# Altium schematic sheet SCH_ARDUINO_UNO-KMA.SchDoc: Arduino Limited Version KMA
size A2; Date: 01/11/2024; Author: Đậu Thành Trung; Organization: ORGANIZATION; Address1: ADDRESS 1; Address2: ADDRESS 2; Address3: ADDRESS 3; Address4: ADDRESS 4; Revision: -; SheetNumber: 1; SheetTotal: 1; Mail: dauthanhtrung.kma@gmail.com; Phone: 0868.24.2509
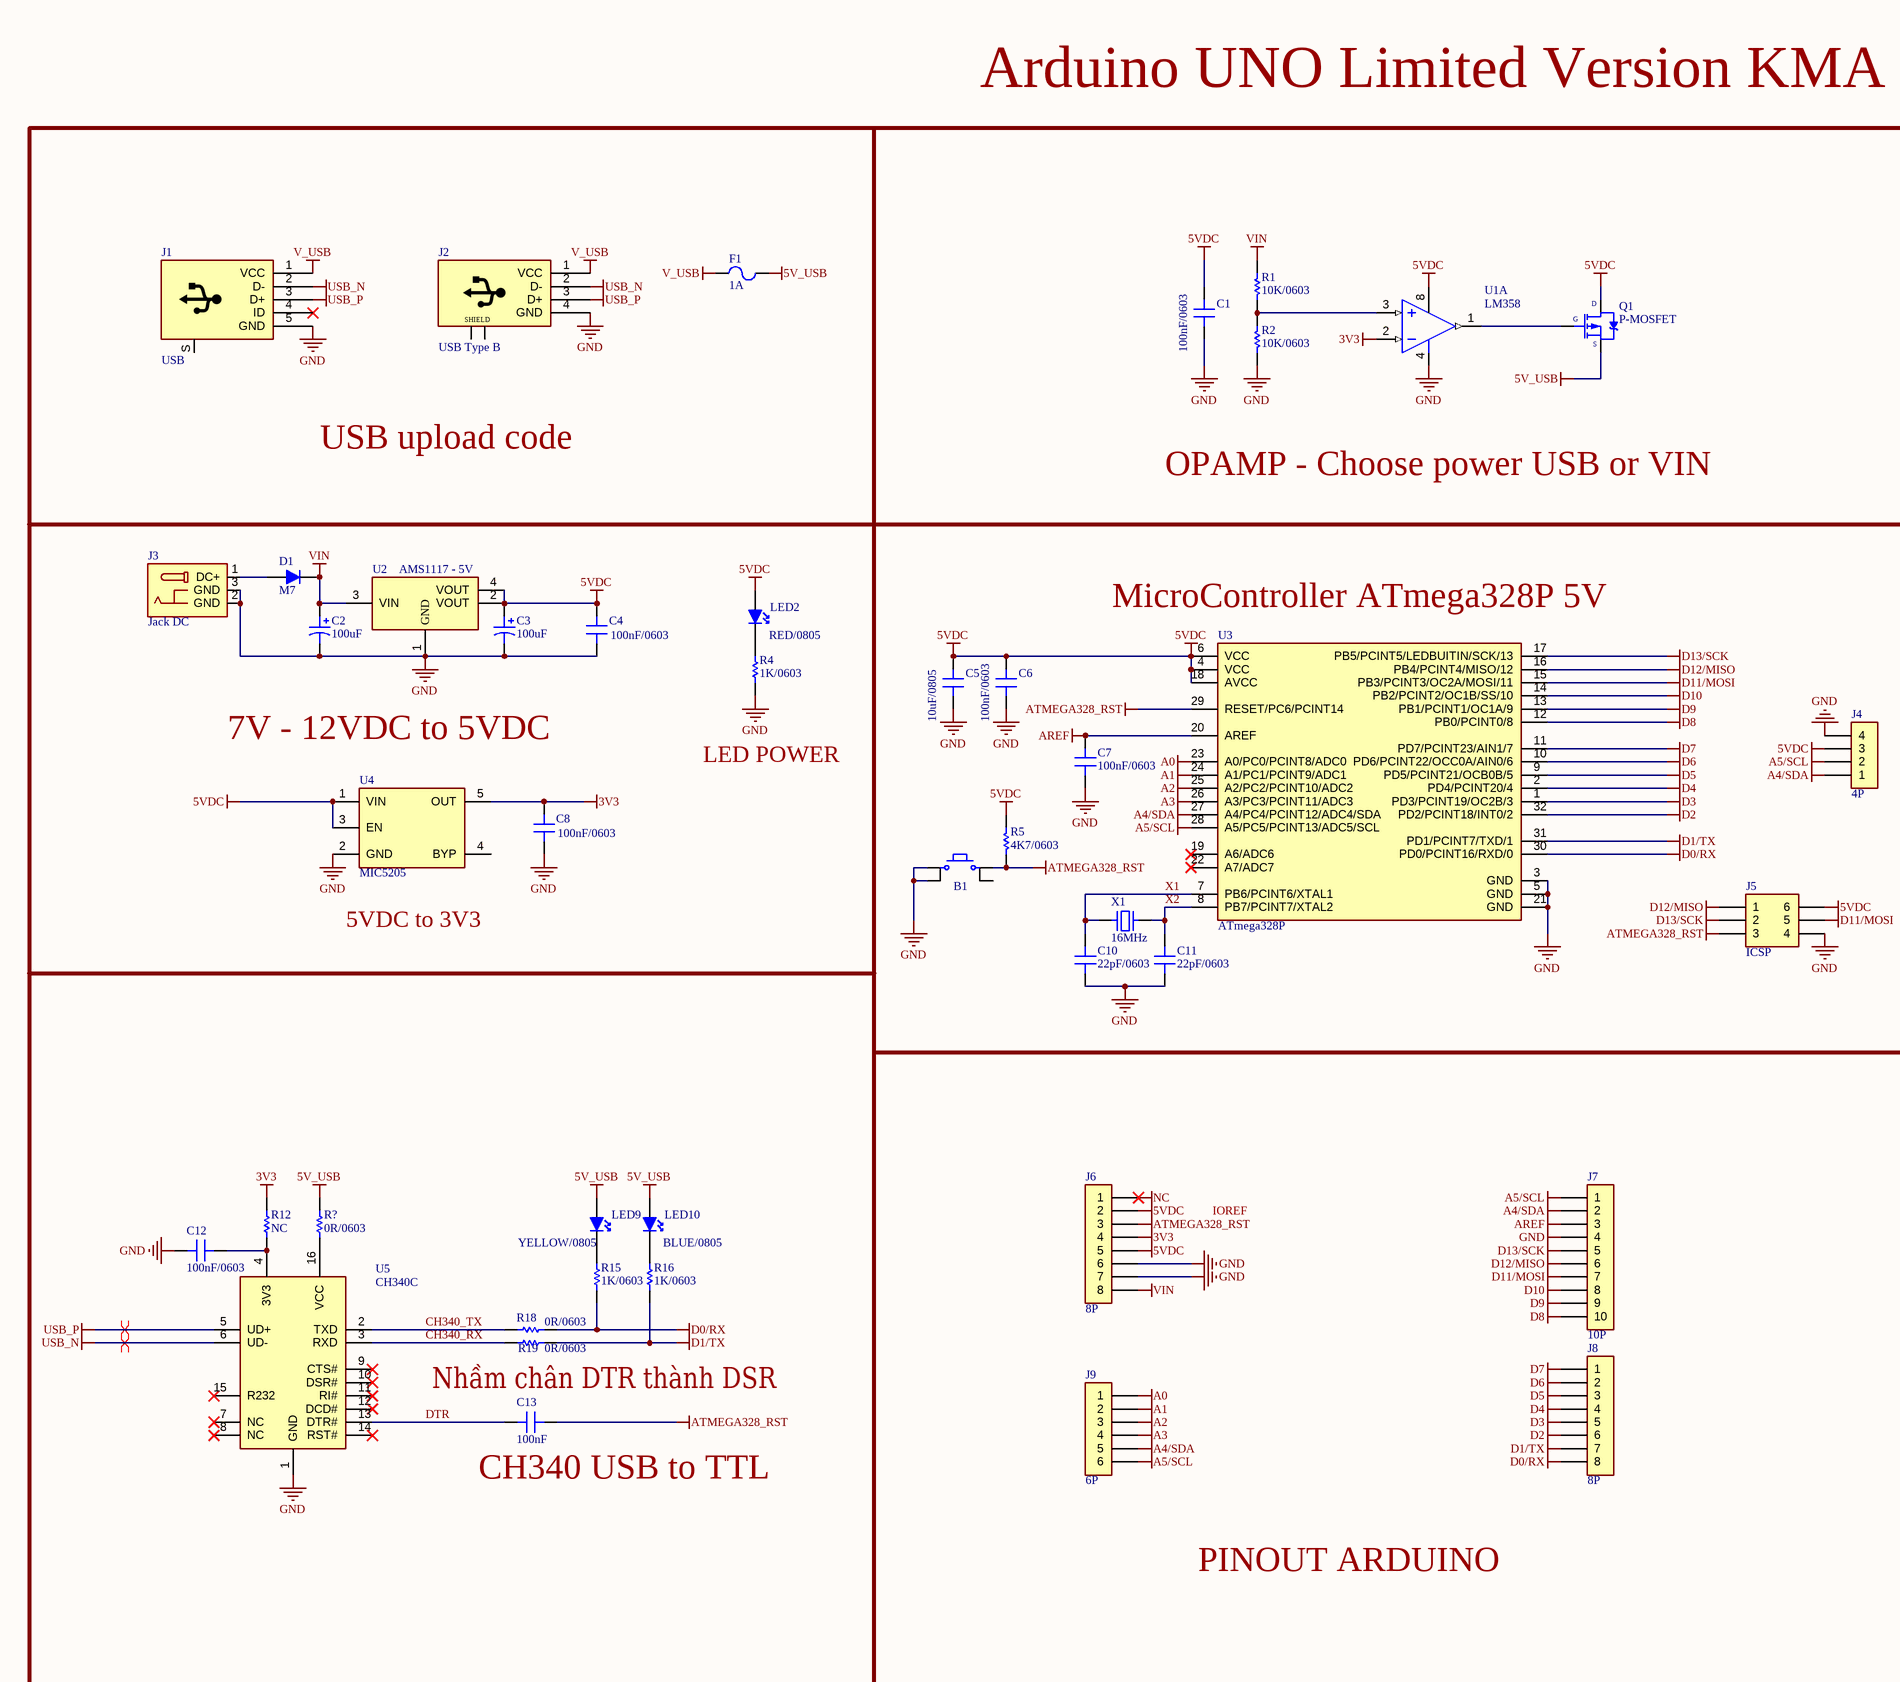
[diagram p0: SCH_ARDUINO_UNO-KMA.SchDoc, left]
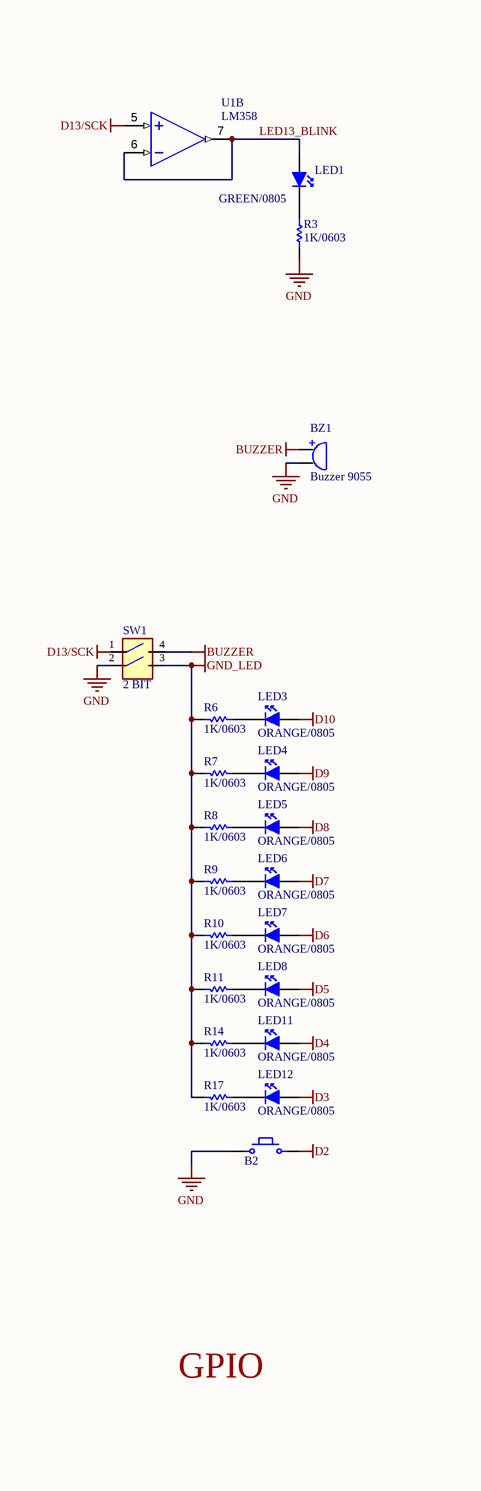
[diagram p1: SCH_ARDUINO_UNO-KMA.SchDoc, right]

## Parts
?  (no value)  (no BOM)
B1  (no value)  [BUTTON-SMD-4P-6X6X3.1MM]
B2  (no value)  [BUTTON-SMD-2P-3x6x5MM]
BZ1  Buzzer 9055  [BUZZER_9055]
C1  100nF/0603  [CAP-0603]
C2  100uF  [CAPP-SMD-ALU-6.3X5.4MM-D]
C3  100uF  [CAPP-SMD-ALU-6.3X5.4MM-D]
C4  100nF/0603  [CAP-0603]
C5  10uF/0805  [CAP-0805]
C6  100nF/0603  [CAP-0603]
C7  100nF/0603  [CAP-0603]
C8  100nF/0603  [CAP-0603]
C10  22pF/0603  [CAP-0603]
C11  22pF/0603  [CAP-0603]
C12  100nF/0603  [CAP-0603]
C13  100nF  [CAP-0603]
D1  M7  [DIODE-SMD-DO-214AC]
F1  1A  [FUSE-SMD-PTC-1206]
J1  USB  [USB-FEMALE-MICRO-DIP]
J2  USB Type B  [USB-FEMALE-TYPE-B]
J3  Jack DC  [JACK-DC-5.5X2.1MM]
J4  4P  [JUMP-2.54-MALE-4P-NB]
J5  ICSP  [JUMP-2.54-MALE-2X3P]  (no BOM)
J6  8P  [JUMP-2.54-FEMALE-8P]
J7  10P  [JUMP-2.54-FEMALE-10P]
J8  8P  [JUMP-2.54-FEMALE-8P]
J9  6P  [JUMP-2.54-FEMALE-6P]
LED1  GREEN/0805  [LED-0805-GREEN]
LED2  RED/0805  [LED-0805-RED]
LED3  ORANGE/0805  [LED-0805-ORANGE]
LED4  ORANGE/0805  [LED-0805-ORANGE]
LED5  ORANGE/0805  [LED-0805-ORANGE]
LED6  ORANGE/0805  [LED-0805-ORANGE]
LED7  ORANGE/0805  [LED-0805-ORANGE]
LED8  ORANGE/0805  [LED-0805-ORANGE]
LED9  YELLOW/0805  [LED-0805-YELLOW]
LED10  BLUE/0805  [LED-0805-BLUE]
LED11  ORANGE/0805  [LED-0805-ORANGE]
LED12  ORANGE/0805  [LED-0805-ORANGE]
Q1  P-MOSFET  [MOSFET-SOT23-123]
R1  10K/0603  [RES-0603]
R2  10K/0603  [RES-0603]
R3  1K/0603  [RES-0603]
R4  1K/0603  [RES-0603]
R5  4K7/0603  [RES-0603]
R6  1K/0603  [RES-0603]
R7  1K/0603  [RES-0603]
R8  1K/0603  [RES-0603]
R9  1K/0603  [RES-0603]
R10  1K/0603  [RES-0603]
R11  1K/0603  [RES-0603]
R12  NC  [RES-0603]
R14  1K/0603  [RES-0603]
R15  1K/0603  [RES-0603]
R16  1K/0603  [RES-0603]
R17  1K/0603  [RES-0603]
R18  0R/0603  [RES-0603]
R19  0R/0603  [RES-0603]
R?  0R/0603  [RES-0603]
SW1  2 BIT  [BIT-SW-2P]
U1  LM358  [SOP-8]  (parts A,B of 2)
U2  AMS1117 - 5V  [SOT-223]
U3  ATmega328P  [TQFP-32]
U4  MIC5205  [SOT-23-5]
U5  CH340C  [SOP-16]
X1  16MHz  [CRYSTAL-SMD-5032-2P]

## Nets
3V3: C8.2 J6.4 R12.2 U1.2(IN-) U4.5(OUT)
5V_USB: F1.2 LED9.1(A) LED10.1(A) Q1.3(S) R?.2
5VDC: C1.2 C3.1(+) C4.2 C5.2 C6.2 J4.3 J5.6 J6.2 J6.5 LED2.1(A) Q1.2(D) R5.1 U1.8(+V) U2.2(VOUT) U2.4(VOUT) U3.4(VCC) U3.6(VCC) U3.18(AVCC) U4.1(VIN) U4.3(EN)
A0: J9.1 U3.23(A0/PC0/PCINT8/ADC0)
A1: J9.2 U3.24(A1/PC1/PCINT9/ADC1)
A2: J9.3 U3.25(A2/PC2/PCINT10/ADC2)
A3: J9.4 U3.26(A3/PC3/PCINT11/ADC3)
A4/SDA: J4.1 J7.2 J9.5 U3.27(A4/PC4/PCINT12/ADC4/SDA)
A5/SCL: J4.2 J7.1 J9.6 U3.28(A5/PC5/PCINT13/ADC5/SCL)
AREF: C7.2 J7.3 U3.20(AREF)
ATMEGA328_RST: B1.1 C13.2 J5.3 J6.3 R5.2 U3.29(RESET/PC6/PCINT14)
BUZZER: BZ1.1 SW1.4
D0/RX: J8.8 R15.2 R18.2 U3.30(PD0/PCINT16/RXD/0)
D1/TX: J8.7 R16.2 R19.2 U3.31(PD1/PCINT7/TXD/1)
D2: B2.2 J8.6 U3.32(PD2/PCINT18/INT0/2)
D3: J8.5 LED12.1(A) U3.1(PD3/PCINT19/OC2B/3)
D4: J8.4 LED11.1(A) U3.2(PD4/PCINT20/4)
D5: J8.3 LED8.1(A) U3.9(PD5/PCINT21/OCB0B/5)
D6: J8.2 LED7.1(A) U3.10(PD6/PCINT22/OCC0A/AIN0/6)
D7: J8.1 LED6.1(A) U3.11(PD7/PCINT23/AIN1/7)
D8: J7.10 LED5.1(A) U3.12(PB0/PCINT0/8)
D9: J7.9 LED4.1(A) U3.13(PB1/PCINT1/OC1A/9)
D10: J7.8 LED3.1(A) U3.14(PB2/PCINT2/OC1B/SS/10)
D11/MOSI: J5.5 J7.7 U3.15(PB3/PCINT3/OC2A/MOSI/11)
D12/MISO: J5.1 J7.6 U3.16(PB4/PCINT4/MISO/12)
D13/SCK: J5.2 J7.5 SW1.1 U1.5(IN+) U3.17(PB5/PCINT5/LEDBUITIN/SCK/13)
GND: B1.2 B1.4 B2.1 BZ1.2 C1.1 C2.2(-) C3.2(-) C4.1 C5.1 C6.1 C7.1 C8.1 C10.2 C11.2 C12.1 J1.5(GND) J2.4(GND) J3.2(GND) J3.3(GND) J4.4 J5.4 J6.6 J6.7 J7.4 R2.2 R3.2 R4.2 SW1.2 U1.4(-V) U2.1(GND) U3.3(GND) U3.5(GND) U3.21(GND) U4.2(GND) U5.1(GND)
GND_LED: R6.1 R7.1 R8.1 R9.1 R10.1 R11.1 R14.1 R17.1 SW1.3
NC: J6.1
USB_N: J1.2(D-) J2.2(D-) U5.6(UD-)
USB_P: J1.3(D+) J2.3(D+) U5.5(UD+)
V_USB: F1.1 J1.1(VCC) J2.1(VCC)
VIN: C2.1(+) D1.C J6.8 R1.1 U2.3(VIN)
CH340_RX: R19.1 U5.3(RXD)
CH340_TX: R18.1 U5.2(TXD)
DTR: C13.1 U5.13(DTR#)
LED13_BLINK: LED1.1(A) U1.6(IN-) U1.7(OUT)
X1: C10.1 U3.7(PB6/PCINT6/XTAL1) X1.1
X2: C11.1 U3.8(PB7/PCINT7/XTAL2) X1.2
NetC12_2: C12.2 R12.1 U5.4(3V3)
NetD1_A: D1.A J3.1(DC+)
NetLED1_2: LED1.2(K) R3.1
NetLED2_2: LED2.2(K) R4.1
NetLED3_2: LED3.2(K) R6.2
NetLED4_2: LED4.2(K) R7.2
NetLED5_2: LED5.2(K) R8.2
NetLED6_2: LED6.2(K) R9.2
NetLED7_2: LED7.2(K) R10.2
NetLED8_2: LED8.2(K) R11.2
NetLED9_2: LED9.2(K) R15.1
NetLED10_2: LED10.2(K) R16.1
NetLED11_2: LED11.2(K) R14.2
NetLED12_2: LED12.2(K) R17.2
NetQ1_1: Q1.1(G) U1.1(OUT)
NetR1_2: R1.2 R2.1 U1.3(IN+)
NetR?_1: R?.1 U5.16(VCC)

Not connected (* = marked no-connect by the designer): B1 3; J1 4(ID)* S(GND); J2 S1(GND) S2(GND); U3 19(A6/ADC6)* 22(A7/ADC7)*; U4 4(BYP); U5 7(NC)* 8(NC)* 9(CTS#)* 10(DSR#)* 11(RI#)* 12(DCD#)* 14(RST#)* 15(R232)*

## Layout directives
differential pair: USB_N, USB_P

## Notes on the sheet
- Arduino UNO Limited Version KMA
- USB upload code
- OPAMP - Choose power USB or VIN
- (near U3) MicroController ATmega328P 5V
- 7V - 12VDC to 5VDC
- LED POWER
- 5VDC to 3V3
- IOREF
- Nhầm chân DTR thành DSR
- (near C13) CH340 USB to TTL
- PINOUT ARDUINO
- GPIO
- Project:
- Date:
- Email:
- Designed by:
- Phone:
- (in symbol BUZZER) +
- (in symbol USB-TYPE-B) SHIELD

## Library data of the parts
? = Title Block
B1 = BUTTON-4PIN: Nút nhấn 4 chân
B2 = BUTTON-2PIN: Nút nhấn 2 chân
BZ1 = BUZZER: Còi chip
C1 C4-C8 C10-C13 = CAP-SMD: Tụ dán
C2 C3 = CAPP-SMD: Tụ hoá dán
D1 = DIODE-SMD: Diode SMD
F1 = FUSE-SMD: Cầu chì SMD
J1 = USB-5P: Cổng USB 5P; Part number: USB-B-Mini
J2 = USB-TYPE-B: Cổng USB TYPE B; Part number: USB-B-Mini
J3 = JACK-DC: Jack nguồn DC
J4 = JUMP-4PIN: Jump 4P
J5 = JUMP-2X3P: Jump 2x3P
J6 J8 = JUMP-8PIN: Jump 8P
J7 = JUMP-10PIN: Jump 10P
J9 = JUMP-6PIN: Jump 6P
LED1-LED12 = LED-SMD: Led dán
Q1 = MOSFET-P-SMD: Mosfet kênh P PNP dán
R1-R12 R14-R19 R? = RES-SMD: Điện trở dán
SW1 = BIT SWITCH 2: Công tắc 2 bit; Name: NDSR-02-V; Case: DNP; Part Number: N/A; Link: *; Note: *
U1 = LM358: IC LM358 OPAMP
U2 = AMS1117: IC AMS1117 IC Nguồn 5V 1A SOT-223
U3 = ATMEGA328P: IC ATmega328P IC MCU 8BIT 32KB FLASH 32P; MP: STM8S003F3P6; MF: STMicroelectronics; Availability: Unavailable; SnapEDA_Link: https://www.snapeda.com/parts/STM8S003F3P6/STMicroelectronics/view-part/47650/?ref=snap; Price: None; Value: *; Package: TSSOP-20 STMicroelectronics
U4 = MIC5205: IC nguồn MIC5205-3.3 KB33 0.15A 3.3V SOT23-5; MF: Aerosemi Technology Co., Ltd; MP: MT3608; Package: Package Analog Devices; Availability: Unavailable; Value: *; SnapEDA_Link: https://www.snapeda.com/parts/MT3608/Aerosemi%20Technology%20Co.%2C%20Ltd/view-part/3218014/?ref=snap; Price: None
U5 = CH340C: IC CH340C Chuyển đổi USB to TTL 2Mbps USB2.0 SOP-16; MP: STM8S003F3P6; MF: STMicroelectronics; Availability: Unavailable; SnapEDA_Link: https://www.snapeda.com/parts/STM8S003F3P6/STMicroelectronics/view-part/47650/?ref=snap; Price: None; Value: *; Package: TSSOP-20 STMicroelectronics
X1 = CRYSTAL-2P: Thạch anh 2P